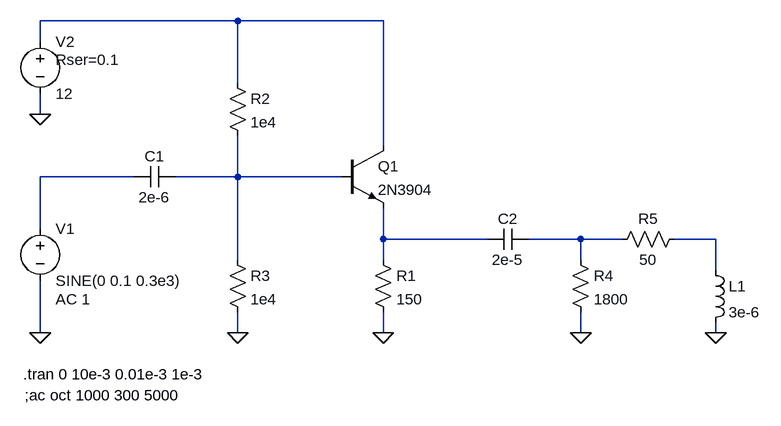
[diagram p0: schematic emitter_follower_mic_audio.asc]
emitter_follower_mic_audio.asc, the LTspice schematic file:
Version 4
SHEET 1 880 680
WIRE -400 -96 -704 -96
WIRE -176 -96 -400 -96
WIRE -704 -64 -704 -96
WIRE -400 0 -400 -96
WIRE -704 48 -704 16
WIRE -176 96 -176 -96
WIRE -560 144 -704 144
WIRE -400 144 -400 80
WIRE -400 144 -496 144
WIRE -240 144 -400 144
WIRE -704 224 -704 144
WIRE -176 240 -176 192
WIRE -16 240 -176 240
WIRE 128 240 48 240
WIRE 192 240 128 240
WIRE 336 240 272 240
WIRE -400 272 -400 144
WIRE -176 272 -176 240
WIRE 128 272 128 240
WIRE 336 288 336 240
WIRE -704 384 -704 304
WIRE -400 384 -400 352
WIRE -176 384 -176 352
WIRE 128 384 128 352
WIRE 336 384 336 368
FLAG -400 384 0
FLAG -176 384 0
FLAG -704 48 0
FLAG -704 384 0
FLAG 128 384 0
FLAG 336 384 0
SYMBOL npn -240 96 R0
SYMATTR InstName Q1
SYMATTR Value 2N3904
SYMBOL res -192 256 R0
SYMATTR InstName R1
SYMATTR Value 150
SYMBOL res -416 -16 R0
SYMATTR InstName R2
SYMATTR Value 1e4
SYMBOL res -416 256 R0
SYMATTR InstName R3
SYMATTR Value 1e4
SYMBOL cap -496 128 R90
WINDOW 0 0 32 VBottom 2
WINDOW 3 32 32 VTop 2
SYMATTR InstName C1
SYMATTR Value 2e-6
SYMBOL cap 48 224 R90
WINDOW 0 0 32 VBottom 2
WINDOW 3 32 32 VTop 2
SYMATTR InstName C2
SYMATTR Value 2e-5
SYMBOL voltage -704 208 R0
WINDOW 123 24 124 Left 2
WINDOW 39 0 0 Left 0
SYMATTR InstName V1
SYMATTR Value SINE(0 0.1 0.3e3)
SYMATTR Value2 AC 1
SYMBOL voltage -704 -80 R0
WINDOW 123 0 0 Left 0
WINDOW 39 24 44 Left 2
SYMATTR InstName V2
SYMATTR Value 12
SYMATTR SpiceLine Rser=0.1
SYMBOL res 112 256 R0
SYMATTR InstName R4
SYMATTR Value 1800
SYMBOL ind 320 272 R0
SYMATTR InstName L1
SYMATTR Value 3e-6
SYMBOL res 288 224 R90
WINDOW 0 0 56 VBottom 2
WINDOW 3 32 56 VTop 2
SYMATTR InstName R5
SYMATTR Value 50
TEXT -730 448 Left 2 !.tran 0 10e-3 0.01e-3 1e-3
TEXT -728 480 Left 2 !;ac oct 1000 300 5000

The netlist it stands for:
* emitter_follower_mic_audio.asc
Q1 N001 N003 N004 0 2N3904
R1 N004 0 150
R2 N001 N003 1e4
R3 N003 0 1e4
C1 N003 N002 2e-6
C2 N005 N004 2e-5
V1 N002 0 SINE(0 0.1 0.3e3) AC 1
V2 N001 0 12 Rser=0.1
R4 N005 0 1800
L1 N006 0 3e-6
R5 N006 N005 50
.model NPN NPN
.model PNP PNP
.lib standard.bjt
.tran 0 10e-3 0.01e-3 1e-3
;ac oct 1000 300 5000
.backanno
.end